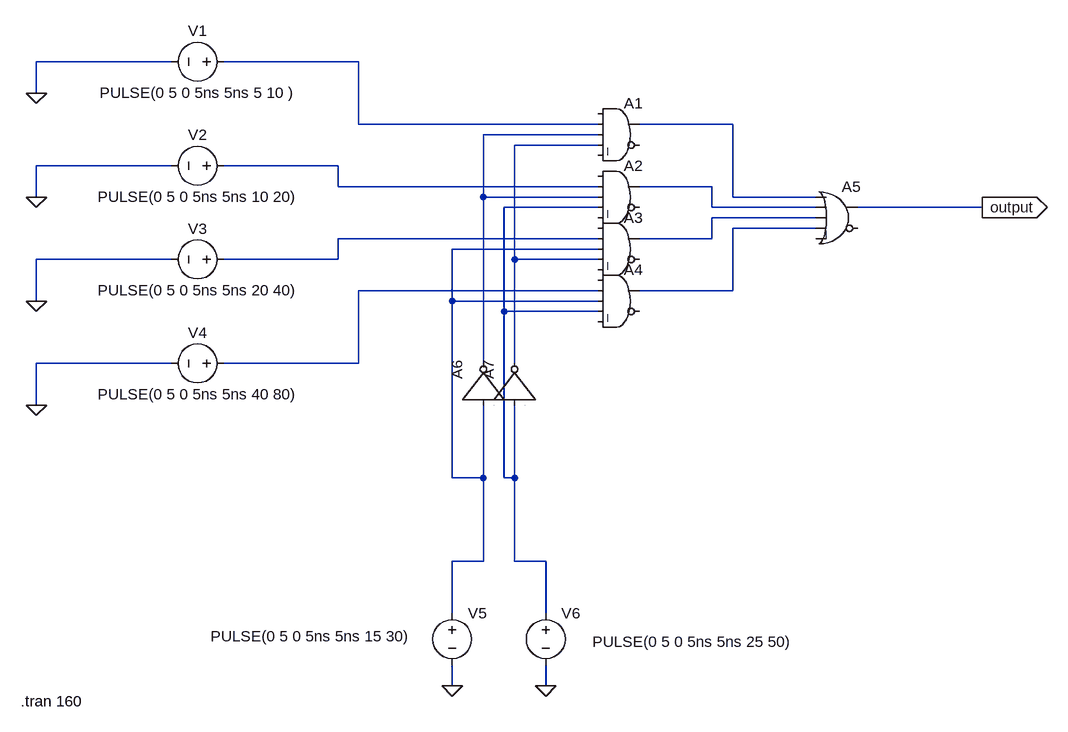
[diagram p0: schematic Mux.asc]
Mux.asc, the LTspice schematic file:
Version 4
SHEET 1 1380 952
WIRE -576 -48 -784 -48
WIRE -288 -48 -496 -48
WIRE -784 0 -784 -48
WIRE -288 48 -288 -48
WIRE 80 48 -288 48
WIRE 288 48 144 48
WIRE 80 64 -96 64
WIRE 80 80 -48 80
WIRE -576 112 -784 112
WIRE -320 112 -496 112
WIRE -320 144 -320 112
WIRE 80 144 -320 144
WIRE 256 144 144 144
WIRE -784 160 -784 112
WIRE -96 160 -96 64
WIRE 80 160 -96 160
WIRE 288 160 288 48
WIRE 416 160 288 160
WIRE 80 176 -64 176
WIRE 256 176 256 144
WIRE 416 176 256 176
WIRE 672 176 480 176
WIRE 416 192 256 192
WIRE 416 208 288 208
WIRE 80 224 -320 224
WIRE 256 224 256 192
WIRE 256 224 144 224
WIRE 80 240 -144 240
WIRE -576 256 -784 256
WIRE -320 256 -320 224
WIRE -320 256 -496 256
WIRE -48 256 -48 80
WIRE 80 256 -48 256
WIRE 80 304 -288 304
WIRE 288 304 288 208
WIRE 288 304 144 304
WIRE -784 320 -784 256
WIRE -144 320 -144 240
WIRE 80 320 -144 320
WIRE -64 336 -64 176
WIRE 80 336 -64 336
WIRE -576 416 -784 416
WIRE -288 416 -288 304
WIRE -288 416 -496 416
WIRE -96 416 -96 160
WIRE -48 416 -48 256
WIRE -784 480 -784 416
WIRE -144 592 -144 320
WIRE -96 592 -96 480
WIRE -96 592 -144 592
WIRE -64 592 -64 336
WIRE -48 592 -48 480
WIRE -48 592 -64 592
WIRE -96 720 -96 592
WIRE -96 720 -144 720
WIRE -48 720 -48 592
WIRE 0 720 -48 720
WIRE -144 800 -144 720
WIRE 0 800 0 720
WIRE -144 912 -144 880
WIRE 0 912 0 880
FLAG -784 0 0
FLAG -784 160 0
FLAG -784 320 0
FLAG -784 480 0
FLAG -144 912 0
FLAG 0 912 0
FLAG 672 176 output
IOPIN 672 176 Out
SYMBOL Digital\\and 112 0 R0
SYMATTR InstName A1
SYMBOL Digital\\and 112 96 R0
SYMATTR InstName A2
SYMBOL Digital\\and 112 176 R0
SYMATTR InstName A3
SYMBOL Digital\\and 112 256 R0
SYMATTR InstName A4
SYMBOL Digital\\or 448 128 R0
SYMATTR InstName A5
SYMBOL Digital\\inv -160 480 R270
SYMATTR InstName A6
SYMBOL Digital\\inv -112 480 R270
SYMATTR InstName A7
SYMBOL voltage -480 -48 R90
WINDOW 0 -32 56 VBottom 2
WINDOW 3 32 56 VTop 2
WINDOW 123 0 0 Left 0
WINDOW 39 0 0 Left 0
SYMATTR InstName V1
SYMATTR Value PULSE(0 5 0 5ns 5ns 5 10 )
SYMBOL voltage -480 112 R90
WINDOW 0 -32 56 VBottom 2
WINDOW 3 32 56 VTop 2
WINDOW 123 0 0 Left 0
WINDOW 39 0 0 Left 0
SYMATTR InstName V2
SYMATTR Value PULSE(0 5 0 5ns 5ns 10 20)
SYMBOL voltage -480 256 R90
WINDOW 0 -32 56 VBottom 2
WINDOW 3 32 56 VTop 2
WINDOW 123 0 0 Left 0
WINDOW 39 0 0 Left 0
SYMATTR InstName V3
SYMATTR Value PULSE(0 5 0 5ns 5ns 20 40)
SYMBOL voltage -480 416 R90
WINDOW 0 -32 56 VBottom 2
WINDOW 3 32 56 VTop 2
WINDOW 123 0 0 Left 0
WINDOW 39 0 0 Left 0
SYMATTR InstName V4
SYMATTR Value PULSE(0 5 0 5ns 5ns 40 80)
SYMBOL voltage -144 784 R0
WINDOW 3 -372 52 Left 2
WINDOW 123 0 0 Left 0
WINDOW 39 0 0 Left 0
SYMATTR Value PULSE(0 5 0 5ns 5ns 15 30)
SYMATTR InstName V5
SYMBOL voltage 0 784 R0
WINDOW 3 72 60 Left 2
WINDOW 123 0 0 Left 0
WINDOW 39 0 0 Left 0
SYMATTR Value PULSE(0 5 0 5ns 5ns 25 50)
SYMATTR InstName V6
TEXT -808 936 Left 2 !.tran 160

The netlist it stands for:
* Mux.asc
A1 0 N001 N003 N004 0 0 N002 0 AND
A2 0 N005 N003 N007 0 0 N006 0 AND
A3 0 N010 N011 N004 0 0 N008 0 AND
A4 0 N012 N011 N007 0 0 N009 0 AND
A5 N002 N006 N008 N009 0 0 output 0 OR
A6 N011 0 0 0 0 N003 0 0 BUF
A7 N007 0 0 0 0 N004 0 0 BUF
V1 N001 0 PULSE(0 5 0 5ns 5ns 5 10 )
V2 N005 0 PULSE(0 5 0 5ns 5ns 10 20)
V3 N010 0 PULSE(0 5 0 5ns 5ns 20 40)
V4 N012 0 PULSE(0 5 0 5ns 5ns 40 80)
V5 N011 0 PULSE(0 5 0 5ns 5ns 15 30)
V6 N007 0 PULSE(0 5 0 5ns 5ns 25 50)
.tran 160
.backanno
.end